# Altium project ESP-03.PrjPcb
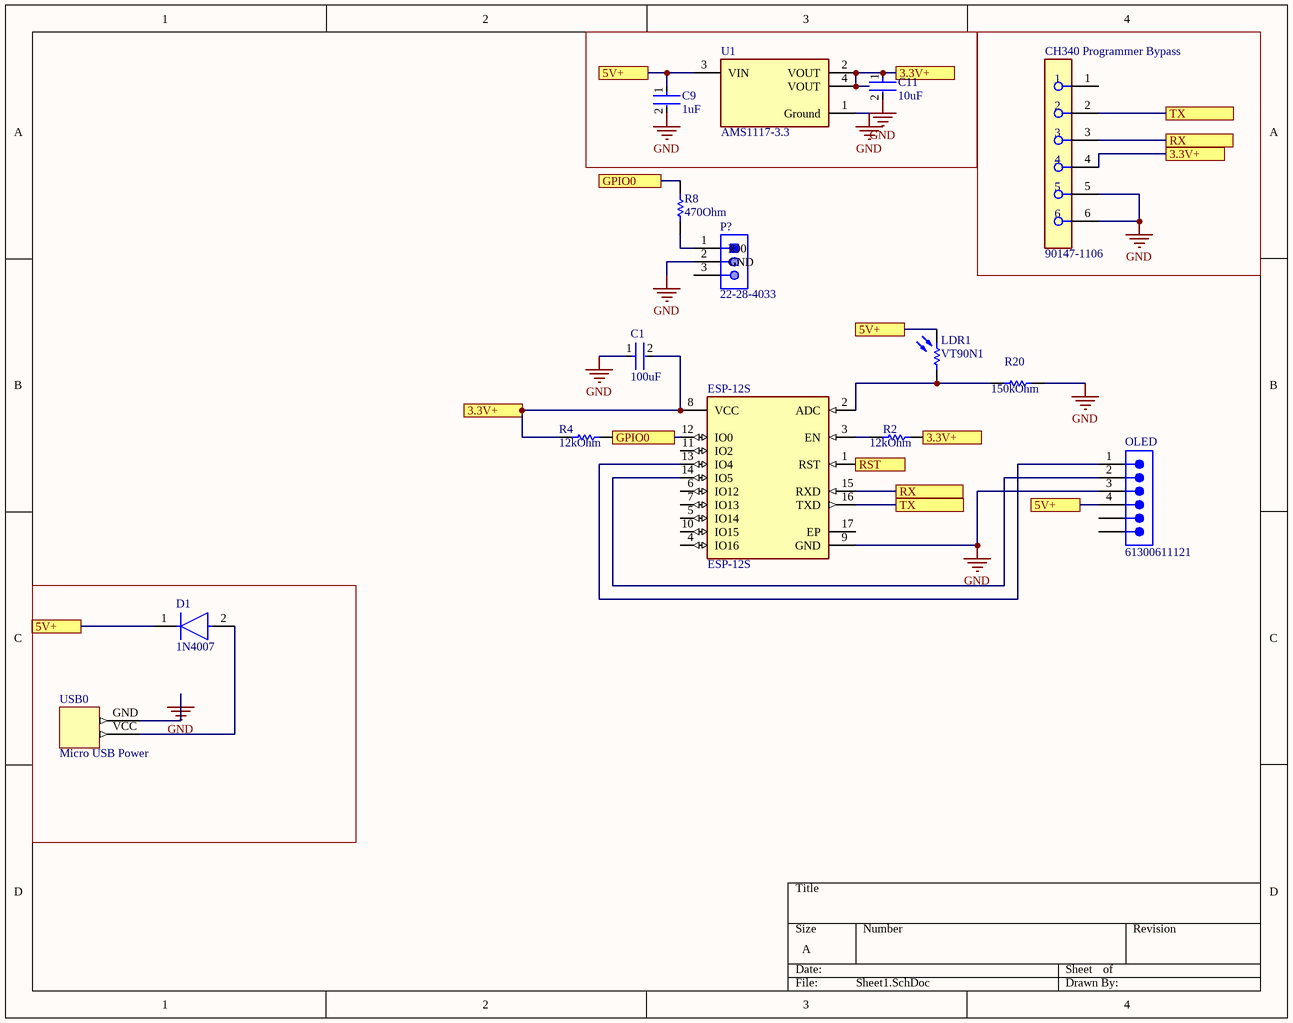
[diagram p0: Sheet1.SchDoc]
1 sheet, 15 parts. Net scope: flat (ports and power ports of the same name join across sheets).
Board file: PCB1.PcbDoc

## Sheet Sheet1.SchDoc
size A; SheetNumber: 1; SheetTotal: 1

### Parts
C1  Capacitance: 100uF  [FP-0603-L_1_6_0_15-W_0_81-IPC_A]  (hidden comment: 06035C102KAT2A)
C9  Capacitance: 1uF  [FP-0603-L_1_6_0_15-W_0_81-IPC_A]  (hidden comment: 06035C102KAT2A)
C11  Capacitance: 10uF  [FP-0603-L_1_6_0_15-W_0_81-IPC_A]  (hidden comment: 06035C102KAT2A)
CH340_Programmer_Bypass  90147-1106  [FP-90147-1106-MFG]
D1  1N4007  [FP-1N4007E-E3-54-MFG]
ESP-12S  ESP-12S  [FP-ESP-12S-MFG]
LDR1  VT90N1  [EXCE-VT90N1]
OLED  61300611121  [61300611121]
P?  22-28-4033  [MOLX-22-28-4033_V]
R2  Resistance: 12kOhm  [RESC1608X55X25ML10T15]  (hidden comment: RC0603JR-070RL)
R4  Resistance: 12kOhm  [RESC1608X55X25ML10T15]  (hidden comment: RC0603JR-070RL)
R8  Resistance: 470Ohm  [RESC1608X55X25ML10T15]  (hidden comment: RC0603JR-070RL)
R20  Resistance: 150kOhm  [RESC1608X55X25ML10T15]  (hidden comment: RC0603JR-070RL)
U1  AMS1117-3.3  [FP-AMS1117-IPC_C]
USB0  Micro USB Power  [New footprint 1]

### Ports
3.3V+ (see Sheet1[2B], Sheet1[3A], Sheet1[3B]), 3.3V+ (see Sheet1[2B], Sheet1[3A], Sheet1[4A]), 3.3V+ (see Sheet1[2B], Sheet1[3B], Sheet1[4A]), 3.3V+ (see Sheet1[3A], Sheet1[3B], Sheet1[4A]), 5V+ (see Sheet1[1C], Sheet1[2A], Sheet1[3B]), 5V+ (see Sheet1[1C], Sheet1[2A], Sheet1[4B]), 5V+ (see Sheet1[1C], Sheet1[3B], Sheet1[4B]), 5V+ (see Sheet1[2A], Sheet1[3B], Sheet1[4B]), GPIO0 (see Sheet1[2A]), GPIO0 (see Sheet1[2B]), RST, RX (see Sheet1[3B]), RX (see Sheet1[4A]), TX (see Sheet1[3B]), TX (see Sheet1[4A])

### Nets
GND: C1.1 C9.2 C11.2 CH340_Programmer_Bypass.5 CH340_Programmer_Bypass.6 ESP-12S.9(GND) OLED.3 P?.2(GND) R20.2 U1.1(Ground) USB0.GND
NetC1_2: C1.2 C11.1 CH340_Programmer_Bypass.4 ESP-12S.8(VCC) R2.2 R4.1 U1.2(VOUT) U1.4(VOUT) ; port 3.3V+
NetC9_1: C9.1 D1.1(C) LDR1.2 OLED.4 U1.3(VIN) ; port 5V+
NetCH340_Programmer_Bypass_2: CH340_Programmer_Bypass.2 ESP-12S.16(TXD) ; port TX
NetCH340_Programmer_Bypass_3: CH340_Programmer_Bypass.3 ESP-12S.15(RXD) ; port RX
NetD1_2: D1.2(A) USB0.VCC
NetESP-12S_1: ESP-12S.1(RST) ; port RST
NetESP-12S_2: ESP-12S.2(ADC) LDR1.1 R20.1
NetESP-12S_3: ESP-12S.3(EN) R2.1
NetESP-12S_12: ESP-12S.12(IO0) R4.2 R8.2 ; port GPIO0
NetESP-12S_13: ESP-12S.13(IO4) OLED.1(VDD)
NetESP-12S_14: ESP-12S.14(IO5) OLED.2(GND)
NetP?_1: P?.1(IO0) R8.1

Not connected (* = marked no-connect by the designer): CH340_Programmer_Bypass 1; ESP-12S 4(IO16) 5(IO14) 6(IO12) 7(IO13) 10(IO15) 11(IO2) 17(EP); OLED 5 6; P? 3

### Library data of the parts
C1 C9 C11 = CMP-2006-04378-2: General Purpose Ceramic Capacitor, 0603, 1nF, 10%, X7R, 15%, 50V; Case Code (Metric): 1608; Min Operating Temperature: -55°C; Weight: 7.1E-05oz; Series: -; RoHS Compliant: Yes; Radiation Hardening: No; Height: 0.9mm; Mount: Surface Mount; REACH SVHC: No SVHC; Lead Free: Lead Free; Depth: 0.81mm; Voltage: 50V; Number of Pins: 2; Voltage Rating: 50V; Max Operating Temperature: 125°C; Termination: SMD/SMT; Construction: Flat; Case Code (Imperial): 0603; Dielectric: X7R; Width: 0.032inch; Tolerance: 10%; Case/Package: 0603; Contact Plating: Tin; Packaging: Tape and Reel; Voltage Rating (DC): 50V; Dielectric Material: Ceramic; Package Quantity: 4000; Thickness: 0.035inch; Length: 1.6mm
CH340_Programmer_Bypass = CMP-00257-00773391-1: 90147-1106 C-Grid PC Board Connector, Single Row, Vertical, 6 Circuits, Tin (Sn) Plating; Manufacturer Lifecycle Status: ACTIVE; NexarPartId: 773391; Number of Circuits: 6; Voltage Rating: 350V; Glow Wire Compliant: Non-compliant; Pitch: 2.54mm; Current Rating: 3A; Gender: Receptacle; RoHS: Compliant; Orientation: Vertical; Contact Material: Bronze; Flammability Rating: UL94 V-0; Min Operating Temperature: -55°C; Plating: Tin; Contact Gender: Female; Material: Bronze; Max Operating Temperature: 125°C; Number of Rows: 1; Mount: Through Hole; Number of Contacts: 6; Number of Positions: 6; Housing Material: Polyester; Contact Plating: Tin; Radiation Hardening: No; Lifecycle Status: Production; Termination: Through Hole; Country of Origin: SG
D1 = CMP-02540-000087-1: DIODE GEN PURP 1KV 1A DO204AL; Peak Non-Repetitive Surge Current: 45A; Forward Voltage: 1.1V; Element Configuration: Single; Max Reverse Current: 5uA; Max Repetitive Reverse Voltage (Vrrm): 1kV; RoHS Compliant: Yes; Max Surge Current: 45A; Min Operating Temperature: -50°C; Radiation Hardening: No; Average Rectified Current: 1A; Series: -; Packaging: Tape and Reel; Contact Plating: Tin; Package Quantity: 5500; Max Reverse Voltage (DC): 1kV; Reverse Voltage: 1kV; Number of Pins: 2; Max Operating Temperature: 150°C; Case/Package: DO-41; Mount: Through Hole
ESP-12S = CMP-204316-000002-1: RX TXRX MOD WIFI PCB TRACE SMD; Interface: I2C; Sensitivity: -90dBm; Data Rate: 54Mbps; Frequency: 2.484GHz; Series: -
LDR1 = CMP-2000-07406-1: Photoconductive Resistor, 200 kOhm, 100 V, 80 mW, -40 to 75 degC, 2-Pin THD, RoHS; Manufacturer: Excelitas Technology; SVHC: Cadmiumchloride(15-Jun-2015); Power Rating: 80mW; Resistance @ Lux: 12kohm; Voltage Rating: 100V; Product Range: -; Datasheet Version: 09/2006; Resistor Case Style: -; Operating Temperature Max: 75°C; Package Reference: VT90N1; Datasheet URL: http://datasheet.octopart.com/VT90N1-Excelitas-datasheet-10388451.pdf; Mounting Technology: ThroughHole; Operating Temperature Min: -40°C; Dark Resistance: 200kohm; Package Description: 2-Pin Through Hole Device, Body Width 4.17 mm (Max), Height 2.29 mm; Manufacturer URL: http://www.excelitas.com/Pages/Index.aspx; Packaging: Each
OLED = CMP-1502-01070-3: NexarPartId: 20084590; Current Rating: 3A; Pitch: 2.54mm; Gender: Male; Operating Supply Voltage: 250V; Connector Type: Male Pin; Number of Positions: 4; Contact Resistance: 20mΩ; Packaging: Bulk; Number of Pins: 4; Number of Rows: 1; Contact Plating: Gold; Lead Free: Lead Free; RoHS: Compliant; Contact Mating Length: 5.9944mm; Voltage Rating: 250V; REACH SVHC: Unknown; Contact Gender: Male; Housing Material: PBT; Min Operating Temperature: -40°C; Lead Pitch: 2.54mm; Mount: Through Hole; Number of Contacts: 4; Max Operating Temperature: 105°C; Contact Material: Copper; Orientation: Vertical; Termination: Through Hole; Color: Black; Height: 8.89mm
P? = CMP-1676-00001-5: Male Header, Pitch 2.54 mm, 1 x 3 Position, Height 8.38 mm, Tail Length 3.18 mm, RoHS, Bulk; Manufacturer: Molex; Rows: 1; Voltage Rating: 250 V; Current Rating: 4 A; Min Operating Temperature: 0 degC; Lead Pitch: 0.1 inch; Packaging: Bulk; Contact Finish: Gold; RoHSCompliant: true; Contact Material: Brass; PackageReference: 22-28-4033; REACH SVHC: Unknown; PackageDescription: Male Header, Pitch 2.54 mm, 1 x 3 Position, Height 8.38 mm, Tail Length 3.18 mm; ComponentLink2URL: http://www.molex.com/pdm_docs/sd/022284033_sd.pdf; Height: 8.38 mm; Mounting Technology: Through Hole; ComponentLink1Description: Manufacturer URL; Length: 7.62 mm; Mount: Through Hole; DatasheetVersion: Rev. G, 01/2012; Max Operating Temperature: 75 degC; ComponentLink2Description: Datasheet; Colour: Black; Pins: 3; Contact Plating: Gold; Package Quantity: 1; ComponentLink1URL: http://www.molex.com/
R2 R4 R8 R20 = CMP-2100-03667-1: Chip Resistor, 0 Ohm, +/- 5%, 0.1 W, -55 to 155 degC, 0603 (1608 Metric), RoHS, Tape and Reel; Manufacturer: Yageo; Temperature Coefficient: 200ppm/degreesC; Voltage Rating: 50V; Power Rating: 100mW; Width: 0.8mm; Max Operating Temperature: 155degC; Tolerance: 5%; Package Reference: 0603; Height: 0.45mm; Depth: 0.8mm; Package Description: 2-Pin Surface Mount Device, Body 1.6 x 0.8 mm; Termination: SMD/SMT; Package Quantity: 5000; Case/Package: 0603; Case Code (Imperial): 0603; Radiation Hardening: No; Number of Pins: 2; Length: 1.6mm; Lead Free: LeadFree; Voltage Rating (DC): 50V; Military Standard: Not; Datasheet URL: http://www.yageo.com/NewPortal/yageodocoutput?fileName=/pdf/R-Chip/PYu-RC_Group_51_RoHS_L_5.pdf; Manufacturer URL: http://www.yageo.com/; Packaging: TapeandReel; Case Code (Metric): 1608; Min Operating Temperature: -55degC; Composition: ThickFilm; RoHSCompliant: true; Contact Plating: Tin; Datasheet Version: Rev. 5, 10/2016; REACH SVHC: NoSVHC
U1 = CMP-209535-000001-1: LDO Voltage Regulators 1A, 3.3V; Manufacturer: Advanced Monolithic Systems; Dropout Voltage: 1.1V; Output Type: Fixed; Nominal Supply Current: 5mA; Max Power Dissipation: 1.2W; Max Supply Voltage: 15V; Number Of Outputs: 1; Standoff Height: 0.64mm; Max Junction Temp: +125°C; Height: 1.8mm; Package: AMS1117; Device Class L2: Power Management ICs; ComponentLink2Description: Datasheet; ComponentLink2URL: http://www.advanced-monolithic.com/pdf/ds1117.pdf; Category: IC; RoHS: TRUE; Automotive: No; Device Class L1: Integrated Circuits (ICs); Output Current: 1A; Device Class L3: Voltage Regulators - Linear; Temperature: -40°C to +125°C; Output Voltage: 3.3V; Manufacturer Part Number: AMS1117-3.3; Temperature Range Low: -40°C; Octopart: https://octopart.com/ams1117-3.3-advanced+monolithic+systems-25899300; Lead Free: Yes; Ipc Land Pattern Name: SOT229P700X180-4; Temperature Range High: +125°C
USB0 = CMP-00000-1: AliExpress Power only; Connector Type: Micro USB; ComponentLink1URL: https://www.aliexpress.us/item/3256805200931778.html?spm=a2g0o.cart.0.0.5df638daVS0vN6&mp=1&_gl=1*q0htwa*_gcl_au*NjQxNDY5NDMxLjE3MzAwODc0Mjc.*_ga*MTMxMjAwMjU3NTAxNzE4Ny4xNzMwMDg3MzYyMDU5*_ga_VED1YSGNC7*MTczMjMzMzE4OC4yLjEuMTczMjMzNjUxOS41OS4wLjA.&gatewayAdapt=glo2usa#nav-specification